# EAGLE schematic schematic_v2 (EAGLE 7.2.0)
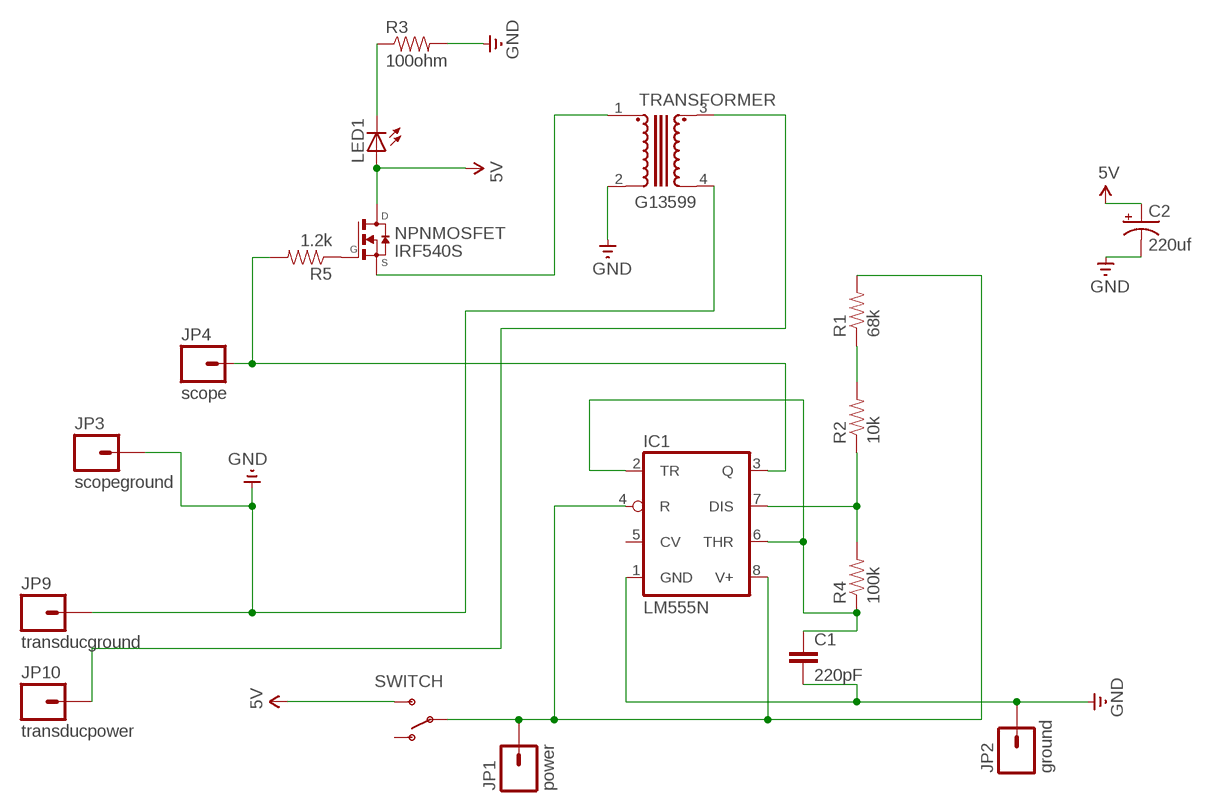
[diagram p0: schematic, sheet 1]

## Parts
C1  220pF  CAPKIT  [CAP-PTH-SMALL-KIT]
C2  220uf  CAP_POLD  [PANASONIC_D]
IC1  LM555N  [DIL08]
JP1  power  M01OFFSET  [1X01_OFFSET]
JP2  ground  M01OFFSET  [1X01_OFFSET]
JP3  scopeground  M01OFFSET  [1X01_OFFSET]
JP4  scope  M01OFFSET  [1X01_OFFSET]
JP9  transducground  M01OFFSET  [1X01_OFFSET]
JP10  transducpower  M01OFFSET  [1X01_OFFSET]
LED1  LED3MM  [LED3MM]
NPNMOSFET  IRF540S  VND7NV04  [DPAK]
R1  68k  RESISTOREZ  [AXIAL-0.3EZ]
R2  10k  RESISTOREZ  [AXIAL-0.3EZ]
R3  100ohm  RESISTOREZ  [AXIAL-0.3EZ]
R4  100k  RESISTOREZ  [AXIAL-0.3EZ]
R5  1.2k  RESISTOREZ  [AXIAL-0.3EZ]
SWITCH  SWITCH-SPDTPTH  [SWITCH-SPDT]
TRANSFORMER  G13599  SP-33  [REDSPEC-1]

## Nets
3.3V: C2.+ LED1.A NPNMOSFET.4(D) SWITCH.3(S) ; supply symbol labelled 5V
GND: C1.2 C2.- IC1.1(GND) JP2.1 JP3.1 JP9.1 R3.P$2 TRANSFORMER.2 TRANSFORMER.4
N$1: C1.1 IC1.2(TR) IC1.6(THR) R4.P$1
N$2: IC1.7(DIS) R2.P$1 R4.P$2
N$3: NPNMOSFET.1(G) R5.P$1
N$4: R1.P$1 R2.P$2
N$5: LED1.K(C) R3.P$1
N$6: NPNMOSFET.3(S) TRANSFORMER.1
N$8: JP10.1 TRANSFORMER.3
N$9: IC1.3(Q) JP4.1 R5.P$2
N$10: IC1.4(R) IC1.8(V+) JP1.1 R1.P$2 SWITCH.2(P)
Unconnected: IC1.5(CV) SWITCH.1(O)

## Library data of the parts
C1 = SparkFun-Capacitors:CAP: Capacitor Standard 0603 ceramic capacitor, and 0.1" leaded capacitor.
C2 = SparkFun-Passives:CAP_POL: Capacitor Polarized These are standard SMD and PTH capacitors. Normally 10uF, 47uF, and 100uF in electrolytic and tantalum varieties. Always verify the external diameter of the through hole cap, it varies with capacity, voltage, and manufacturer. The EIA devices should be standard.
IC1 = linear:*555: TIMER
JP1-JP4 JP9 JP10 = SparkFun-Connectors:M01: Header 1 Standard 1-pin 0.1" header. Use with straight break away headers (SKU : PRT-00116), right angle break away headers (PRT-00553), swiss pins (PRT-00743), machine pins (PRT-00117), and female headers (PRT-00115).
LED1 = SparkFun-LED:LED: LEDs Standard schematic elements and footprints for 5mm, 3mm, 1206, and 0603 sized LEDs. 5mm - Spark Fun Electronics SKU : COM-00529 (and others)
NPNMOSFET = transistor-fet:VND7NV04: POWER MOSFET N-CH OMNIFET-II 40V 6A DPAK
R1-R5 = SparkFun-Resistors:RESISTOR: Resistor Basic schematic elements and footprints for 0603, 1206, and PTH resistors.
SWITCH = SparkFun-Electromechanical:SWITCH-SPDT: SPDT Switch Simple slide switch, Spark Fun Electronics SKU : COM-00102 DPDT SMT slide switch, AYZ0202, SWCH-08179
TRANSFORMER = trafo-triad:SP-33: AUDIO TRANSFORMER Red Spec Series